# EAGLE design imu (EAGLE 5.11)
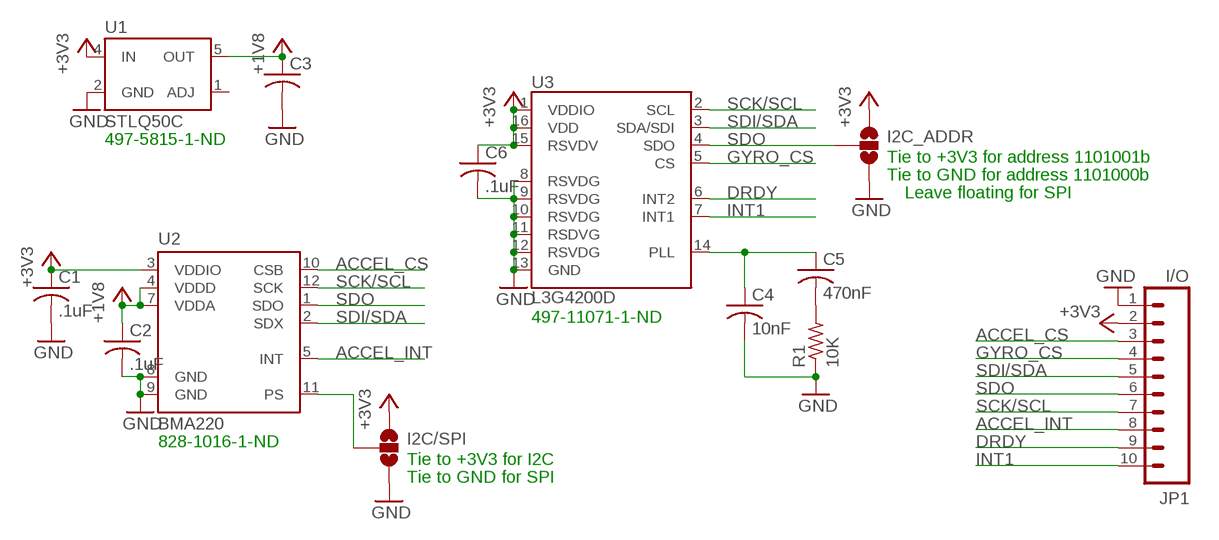
[diagram p0: schematic, sheet 1]

## Parts
C1  .1uF  C-USC0805K  [C0805K]
C2  .1uF  C-USC0805K  [C0805K]
C3  C-USC0805K  [C0805K]
C4  10nF  C-USC0805K  [C0805K]
C5  470nF  C-USC0805K  [C0805K]
C6  .1uF  C-USC0805K  [C0805K]
I2C/SPI  SOLDERJUMPER_2WAY-OLDT  [SJ_2]
I2C_ADDR  SOLDERJUMPER_2WAY-OLDT  [SJ_2]
JP1  I/O  M10LOCK  [1X10_LOCK]
R1  10K  R-US_R0805  [R0805]
U1  STLQ50C  [SOT323-5]
U2  BMA220  [12-LGA]
U3  L3G4200D  [LGA16-4X4]

## Nets
+1V8: C2.1 C3.1 U1.5(OUT) U2.4(VDDD) U2.7(VDDA)
+3V3: C1.1 C6.1 I2C/SPI.1 I2C_ADDR.1 JP1.2 U1.4(IN) U2.3(VDDIO) U3.1(VDDIO) U3.15(RSVDV) U3.16(VDD)
ACCEL_CS: JP1.3 U2.10(CSB)
ACCEL_INT: JP1.8 U2.5(INT)
DRDY: JP1.9 U3.6(INT2)
GND: C1.2 C2.2 C3.2 C4.2 C6.2 I2C/SPI.3 I2C_ADDR.3 JP1.1 R1.1 U1.2(GND) U2.8(GND) U2.9(GND) U3.8(RSVDG) U3.9(RSVDG) U3.10(RSVDG) U3.11(RSDVG) U3.12(RSVDG) U3.13(GND)
GYRO_CS: JP1.4 U3.5(CS)
INT1: JP1.10 U3.7(INT1)
N$1: C5.2 R1.2
N$2: I2C/SPI.2 U2.11(PS)
N$3: C4.1 C5.1 U3.14(PLL)
SCK/SCL: JP1.7 U2.12(SCK) U3.2(SCL)
SDI/SDA: JP1.5 U2.2(SDX) U3.3(SDA/SDI)
SDO: I2C_ADDR.2 JP1.6 U2.1(SDO) U3.4(SDO)
Unconnected: U1.1(ADJ)

## Notes on the sheet
- 497-5815-1-ND
- Tie to +3V3 for address 1101001b
- Tie to GND for address 1101000b
- Leave floating for SPI
- 497-11071-1-ND
- 828-1016-1-ND
- Tie to +3V3 for I2C
- Tie to GND for SPI

## Library data of the parts
C1-C6 = adafruit:C-US: CAPACITOR, American symbol
I2C/SPI I2C_ADDR = SparkFun:SOLDERJUMPER_2WAY-OLD: Solder Jumper 2 way solder jumper
JP1 = SparkFun:M10: Header 10 Standard 10-pin 0.1" header. Use with straight break away headers (SKU : PRT-00116), right angle break away headers (PRT-00553), swiss pins (PRT-00743), machine pins (PRT-00117), and female headers (PRT-00115).
R1 = adafruit:R-US_: RESISTOR, American symbol
U1 = st-microelectronics:STLQ50: STLQ50C 50mA Voltage Regulator Source: STLQ50XX Datasheet <http://www.st.com/internet/com/TECHNICAL_RESOURCES/TECHNICAL_LITERATURE/DATASHEET/CD00151464.pdf>
U2 = bosch:BMA220: BMA220 Triple Axis Accelerometer Triaxial ±2g to ±16g acceleration sensor with on-chip motion-triggered interrupt controller Source: Bosch Sensortec BMA220 Datasheet <http://www.bosch-sensortec.com/content/language1/downloads/BST-BMA220-DS003-07.pdf>
U3 = SparkFun:L3G4200D: L3G4200D Three-axis, digital output gyroscope The L3G4200D is a low-power three-axis angular rate sensor, has a full scale of ±250/±500/±2000 dps and is capable of measuring rates with a user-selectable bandwidth. It includes a sensing element and an IC interface capable of providing the measured angular rate to the external world through a digital interface (I2C/SPI). Package: 4x4x1.1 LGA-16 (LGA16-4x4.PAC)

## Board
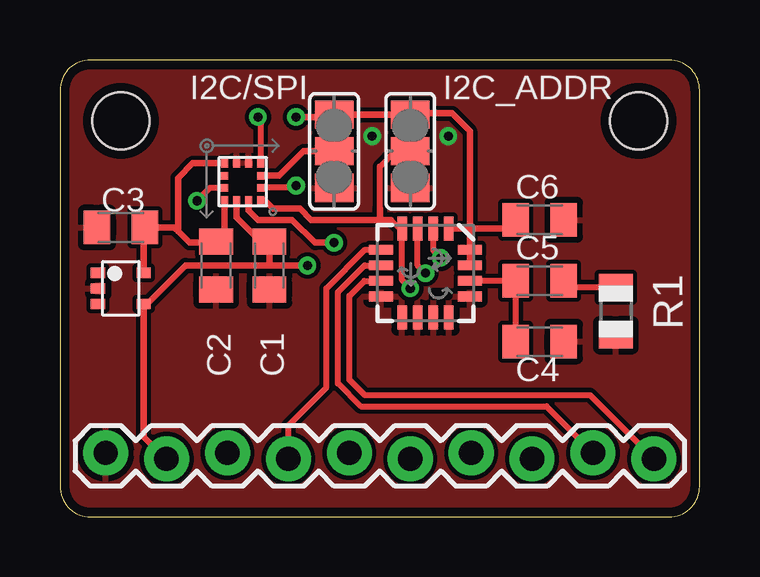
[diagram p1: board, top side]
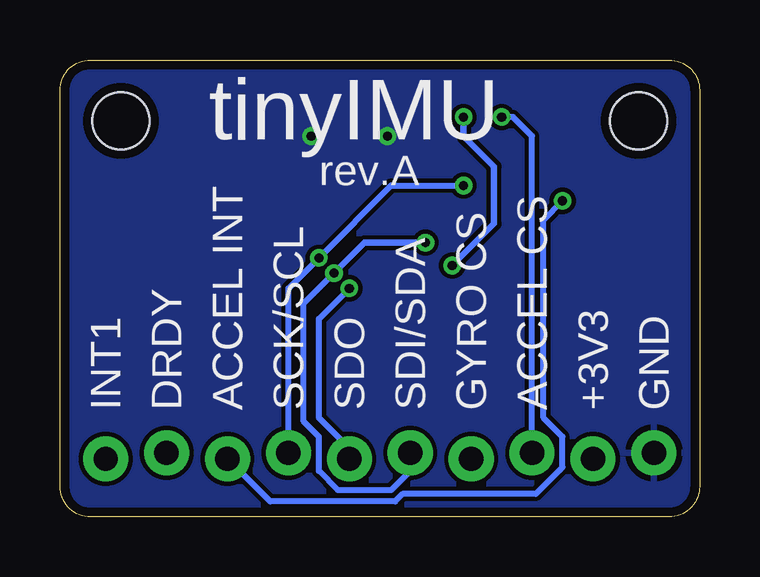
[diagram p2: board, bottom side, seen from below]

Size 26.67 x 19.05 mm. Coordinates in mm from the lower left corner, seen from the top.
Outline: 1.27,19.05 arc90 0,17.78 0,1.27 arc90 1.27,0 25.4,0 arc90 26.67,1.27 26.67,17.78 arc90 25.4,19.05 1.27,19.05
Copper layers (1*16): Top 0.0356mm / dielectric 1.5011mm / Bottom 0.0356mm
Design rules "LaenPCBOrder *": minimum track width 6mil, minimum drill 13mil, track to track 6mil, track to pad 6mil, pad to pad 6mil, via to via 6mil, smd to smd 6mil, copper to edge 15mil, drill to drill 6mil, minimum pad ring 7mil, minimum via ring 7mil, stop-mask expansion 4mil, vias tented up to drill 16mil, thermal gap 10mil
Holes 2.38 mm at 2.54,16.51 24.13,16.51
tRestrict: area 7.1,14.3 to 8.1,14.4; area 15.6,9.2 to 16.2,9.4; 27 lines
bRestrict: 1 lines

### Footprints (pad centres in the part's own frame; a part is rotated, then mirrored left to right if it is on the bottom)
C0805K = smd 1.1 x 1.4: 1 -1,0; 2 1,0
SJ_2 = smd 1.168 x 1.6: 1 -1.524,0; 2 0,0; 3 1.524,0
1X10_LOCK = drill 1.016 pad 1.88 round: 1 0,0.127; 2 2.54,-0.127; 3 5.08,0.127; 4 7.62,-0.127; 5 10.16,0.127; 6 12.7,-0.127; 7 15.24,0.127; 8 17.78,-0.127; 9 20.32,0.127; 10 22.86,-0.127
R0805 = smd 1.1 x 1.4: 1 -1,0; 2 1,0
SOT323-5 = smd 0.42 x 0.6: 1 0.65,0.95; 2 0,0.95; 3 -0.65,0.95; 4 -0.65,-0.95; 5 0.65,-0.95
12-LGA = smd 0.3 x 0.35: 1 0.75,-0.775; 2 0.25,-0.775; 3 -0.25,-0.775; 4 -0.75,-0.775; 7 -0.75,0.775; 8 -0.25,0.775; 9 0.25,0.775; 10 0.75,0.775 | smd 0.35 x 0.3: 5 -0.775,-0.25; 6 -0.775,0.25; 11 0.775,0.25; 12 0.775,-0.25
LGA16-4X4 = smd 1 x 0.4: 1 -1.85,0.975; 2 -1.85,0.325; 3 -1.85,-0.325; 4 -1.85,-0.975; 9 1.85,-0.975; 10 1.85,-0.325; 11 1.85,0.325; 12 1.85,0.975 | smd 0.4 x 1: 5 -0.975,-1.85; 6 -0.325,-1.85; 7 0.325,-1.85; 8 0.975,-1.85; 13 0.975,1.85; 14 0.325,1.85; 15 -0.325,1.85; 16 -0.975,1.85

### Placement (x,y rotation side)
C1  8.73,10.48 270 top
C2  6.51,10.48 270 top
C3  2.54,12.06 180 top
C4  20,7.3 0 top
C5  20,9.84 0 top
C6  20,12.38 0 top
I2C/SPI  11.43,15.24 270 top
I2C_ADDR  14.61,15.24 270 top
JP1  1.91,2.54 0 top
R1  23.18,8.57 90 top
U1  2.54,9.53 90 top
U2  7.62,13.97 0 top
U3  15.24,10.16 270 top

### Tracks (layer width: path | path; a pad name or v marks a point on that pad's centre or on a via)
+1V8
  Top 0.254: 6.46,11.43 C2.1 | 4.76,12.06 4.92,11.91
  Top 0.279: U2.4 6.87,11.84 C2.1 | U1.5 3.49,12.02 C3.1 4.76,12.06 | U2.7 5.54,14.74 4.92,14.13 4.92,11.91 5.4,11.43 6.46,11.43
+3V3  (via drill 0.38)
  Top 0.254: I2C_ADDR.1 14.61,16.51 | 8.73,11.27 8.62,11.38
  Top 0.279: U2.3 7.37,12.47 8.26,11.59 8.62,11.59 | 8.62,11.59 C1.1 | JP1.2 4.41,2.41 3.49,3.33 U1.4 3.64,8.88 5.24,10.48 7.73,10.48 8.73,10.48 | U3.15 U3.16 17.09,11.96 | 17.14,12.01 U3.1 | 17.14,12.01 18.63,12.01 C6.1 | 17.09,11.96 17.14,12.01 | 17.09,11.96 17.09,16.09 16.35,16.83 14.92,16.83 14.61,16.51 | I2C_ADDR.1 I2C/SPI.1 11.34,16.67 v9.84,16.67 | 8.73,10.48 v10.32,10.48 | 8.62,11.38 8.62,11.59 | 8.73,10.48 8.73,11.27
  Bottom 0.279: v10.32,10.48 8.57,12.22 8.57,14.61 9.84,15.88 v9.84,16.67
ACCEL_CS  (via drill 0.38)
  Top 0.254: U2.10 8.37,16.55 v8.26,16.67
  Bottom 0.254: JP1.3 6.99,15.88 7.78,16.67 v8.26,16.67
ACCEL_INT  (via drill 0.38)
  Top 0.254: U2.5 6.26,13.72 v5.71,13.18
  Bottom 0.254: v5.71,13.18 6.51,12.38 6.51,4.13 5.71,3.33 5.71,2.06 6.83,0.95 12.38,0.95 12.7,0.64 17.91,0.64 JP1.8
DRDY
  Top 0.254: U3.6 12.71,10.48 11.59,9.37 11.59,5.56 12.54,4.6 20.29,4.6 JP1.9
GND  (via drill 0.38)
  other vias: 16.19,15.88 13.02,15.88
  pour Top (isolate 0.178): 0,0 26.67,0 26.67,19.05 0,19.05
  pour Bottom (isolate 0.178): 0,0 26.67,0 26.67,19.05 0,19.05
GYRO_CS
  Top 0.254: U3.5 12.72,11.13 11.11,9.53 11.11,5.4 9.53,3.81 JP1.4
INT1
  Top 0.254: U3.7 12.69,9.84 12.06,9.21 12.06,5.71 12.7,5.08 22.1,5.08 JP1.10
N$1
  Top 0.254: R1.2 21.27,9.57 C5.2
N$2
  Top 0.279: U2.11 9.14,14.22 10.16,15.24 I2C/SPI.2
N$3
  Top 0.254: U3.14 C5.1 C4.1
SCK/SCL  (via drill 0.38)
  Top 0.254: U3.2 15.56,11.11 v15.88,10.79 | U2.12 9.75,13.72 v9.84,13.81
  Bottom 0.254: JP1.7 17.14,9.53 v15.88,10.79 12.86,13.81 v9.84,13.81
SDI/SDA  (via drill 0.38)
  Top 0.254: U3.3 14.91,10.48 v15.24,10.16
  Top 0.279: U2.2 7.87,12.77 8.26,12.38 9.68,12.38 10.64,11.43 v11.43,11.43
  Bottom 0.254: v15.24,10.16 16.51,8.89 16.51,3.97 15.88,3.33 15.88,1.91 15.08,1.11 12.86,1.11 12.06,1.91 JP1.5
  Bottom 0.279: v11.43,11.43 13.97,11.43 v15.24,10.16
SDO  (via drill 0.38)
  Top 0.254: 13.81,12.38 14.18,12.01 U3.4 14.27,9.87 v14.61,9.53 | 13.34,12.86 13.34,14.61 13.97,15.24 I2C_ADDR.2
  Top 0.279: U2.1 8.55,13.2 8.89,12.86 10,12.86 10.48,12.38 13.34,12.38 | 13.81,12.38 13.34,12.38 | 13.34,12.38 13.34,12.86
  Bottom 0.254: JP1.6 14.61,2.86 15.88,4.13 15.88,8.26 v14.61,9.53

### Text on the board
bNames: tinyIMU | rev.A | GND | +3V3 | ACCEL CS | GYRO CS | SDI/SDA | SDO | SCK/SCL | ACCEL INT | DRDY | INT1